# EAGLE schematic ServerHardware (EAGLE 9.5.2)
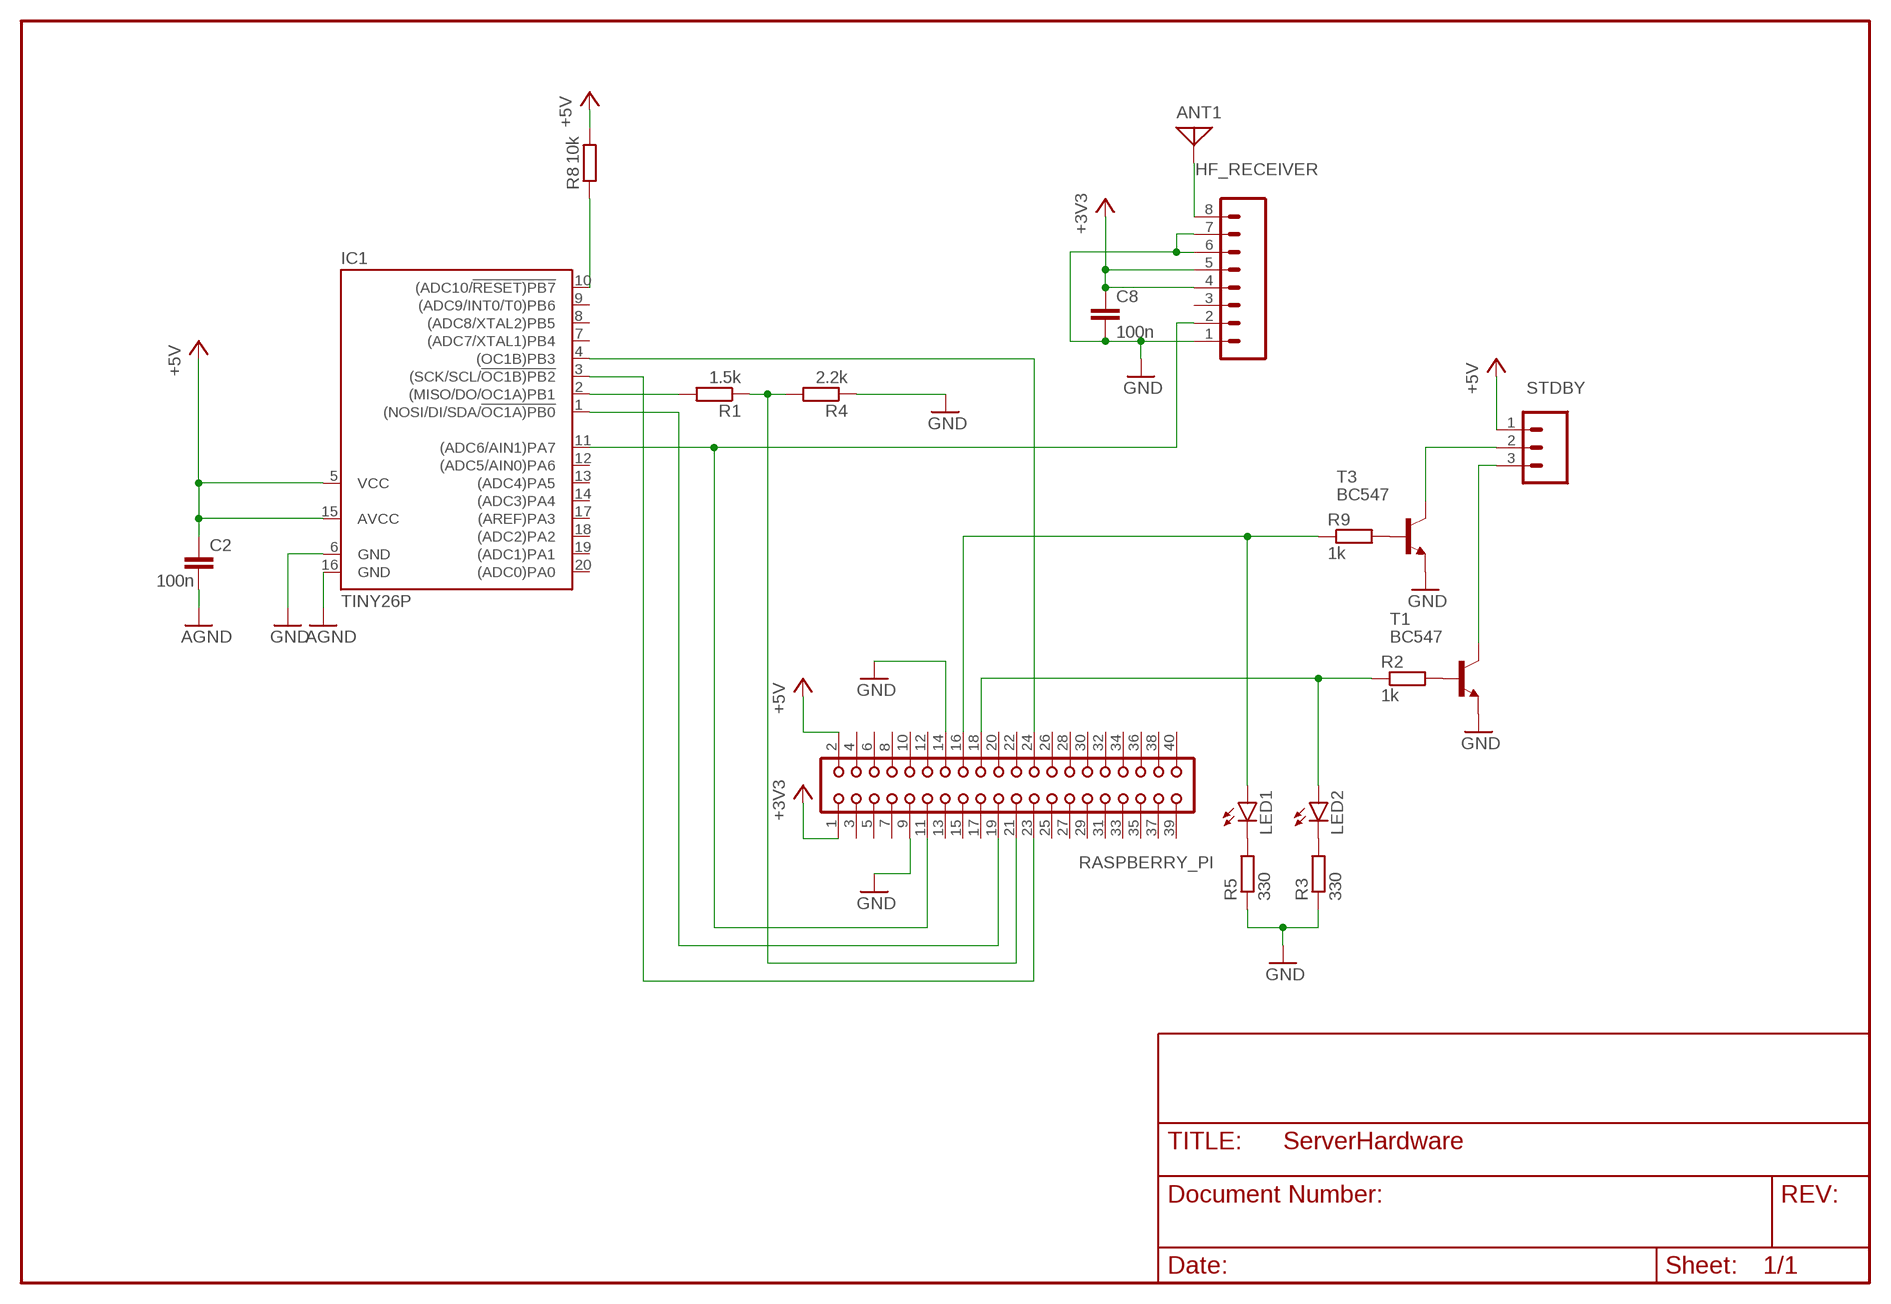
[diagram p0: schematic, sheet 1]

## Parts
ANT1  ANTENNA  [PAD-01]
C2  100n  C-EU025-024X044  [C025-024X044]
C8  100n  C-EU025-024X044  [C025-024X044]
HF_RECEIVER  M08  [08P]
IC1  TINY26P  [DIL20]
LED1  LED5MM  [LED5MM]
LED2  LED5MM  [LED5MM]
R1  1.5k  R-EU_0204/5  [0204/5]
R2  1k  R-EU_0204/5  [0204/5]
R3  330  R-EU_0204/5  [0204/5]
R4  2.2k  R-EU_0204/5  [0204/5]
R5  330  R-EU_0204/5  [0204/5]
R8  10k  R-EU_0204/5  [0204/5]
R9  1k  R-EU_0204/5  [0204/5]
RASPBERRY_PI  CON40  [CON40]
STDBY  M03  [03P]
T1  BC547  [TO92]
T3  BC547  [TO92]

## Nets
+3V3: C8.1 HF_RECEIVER.4 HF_RECEIVER.5 RASPBERRY_PI.1
+5V: C2.1 IC1.5(VCC) IC1.15(AVCC) R8.2 RASPBERRY_PI.2 STDBY.1
GND: C2.2 C8.2 HF_RECEIVER.1 HF_RECEIVER.6 HF_RECEIVER.7 IC1.6(GND) IC1.16(GND) R3.1 R4.1 R5.1 RASPBERRY_PI.9 RASPBERRY_PI.14 T1.1(E) T3.1(E) ; supply symbol labelled AGND
N$1: HF_RECEIVER.2 IC1.11((ADC6/AIN1)PA7) RASPBERRY_PI.11
N$2: IC1.1((NOSI/DI/SDA/!OC1A)PB0) RASPBERRY_PI.19
N$3: IC1.2((MISO/DO/OC1A)PB1) R1.2
N$4: R1.1 R4.2 RASPBERRY_PI.21
N$5: R9.2 T3.2(B)
N$6: IC1.3((SCK/SCL/!OC1B)PB2) RASPBERRY_PI.23
N$7: IC1.4((OC1B)PB3) RASPBERRY_PI.24
N$9: ANT1.1 HF_RECEIVER.8
N$10: R2.2 T1.2(B)
N$11: LED2.A R2.1 RASPBERRY_PI.18
N$12: LED1.A R9.1 RASPBERRY_PI.16
N$13: STDBY.2 T3.3(C)
N$14: STDBY.3 T1.3(C)
N$16: LED1.K(C) R5.2
N$17: LED2.K(C) R3.2
N$21: IC1.10((ADC10/!RESET)PB7) R8.1
Unconnected: HF_RECEIVER.3 IC1.7((ADC7/XTAL1)PB4) IC1.8((ADC8/XTAL2)PB5) IC1.9((ADC9/INT0/T0)PB6) IC1.12((ADC5/AIN0)PA6) IC1.13((ADC4)PA5) IC1.14((ADC3)PA4) IC1.17((AREF)PA3) IC1.18((ADC2)PA2) IC1.19((ADC1)PA1) IC1.20((ADC0)PA0) RASPBERRY_PI.3 RASPBERRY_PI.4 RASPBERRY_PI.5 RASPBERRY_PI.6 RASPBERRY_PI.7 RASPBERRY_PI.8 RASPBERRY_PI.10 RASPBERRY_PI.12 RASPBERRY_PI.13 RASPBERRY_PI.15 RASPBERRY_PI.17 RASPBERRY_PI.20 RASPBERRY_PI.22 RASPBERRY_PI.25 RASPBERRY_PI.26 RASPBERRY_PI.27 RASPBERRY_PI.28 RASPBERRY_PI.29 RASPBERRY_PI.30 RASPBERRY_PI.31 RASPBERRY_PI.32 RASPBERRY_PI.33 RASPBERRY_PI.34 RASPBERRY_PI.35 RASPBERRY_PI.36 RASPBERRY_PI.37 RASPBERRY_PI.38 RASPBERRY_PI.39 RASPBERRY_PI.40

## Library data of the parts
ANT1 = discrete:ANTENNA: Antenna
C2 C8 = rcl:C-EU: CAPACITOR, European symbol
HF_RECEIVER = con-amp-quick:M08: AMP QUICK CONNECTOR; OC_FARNELL: unknown; OC_NEWARK: unknown
IC1 = atmel:TINY26*: 8-bit AVR Microcontroller with 2K Bytes Flash Source: http://www.atmel.com .. doc1477.pdf
LED1 LED2 = led:LED: LED OSRAM: - CHIPLED LG R971, LG N971, LY N971, LG Q971, LY Q971, LO R971, LY R971 LH N974, LH R974 LS Q976, LO Q976, LY Q976 LO Q996 - Hyper CHIPLED LW Q18S LB Q993, LB Q99A, LB R99A - SideLED LS A670, LO A670, LY A670, LG A670, LP A670 LB A673, LV A673, LT A673, LW A673 LH A674 LY A675 LS A676, LA A676, LO A676, LY A676, LW A676 LS A679, LY A679, LG A679 - Hyper Micro SIDELED® LS Y876, LA Y876, LO Y876, LY Y876 LT Y87S - SmartLED LW L88C, LW L88S LB L89C, LB L89S, LG L890 LS L89K, LO L89K, LY L89K LS L896, LA L896, LO L896, LY L896 - TOPLED LS T670, LO T670, LY T670, LG T670, LP T670 LSG T670, LSP T670, LSY T670, LOP T670, LYG T670 LG T671, LOG T671, LSG T671 LB T673, LV T673, LT T673, LW T673 LH T674 LS T676, LA T676, LO T676, LY T676, LB T676, LH T676, LSB T676, LW T676 LB T67C, LV T67C, LT T67C, LS T67K, LO T67K, LY T67K, LW E67C LS E67B, LA E67B, LO E67B, LY E67B, LB E67C, LV E67C, LT E67C LW T67C LS T679, LY T679, LG T679 LS T770, LO T770, LY T770, LG T770, LP T770 LB T773, LV T773, LT T773, LW T773 LH T774 LS E675, LA E675, LY E675, LS T675 LS T776, LA T776, LO T776, LY T776, LB T776 LHGB T686 LT T68C, LB T68C - Hyper Mini TOPLED® LB M676 - Mini TOPLED Santana® LG M470 LS M47K, LO M47K, LY M47K Source: http://www.osram.convergy.de LUXEON: - LUMILED® LXK2-PW12-R00, LXK2-PW12-S00, LXK2-PW14-U00, LXK2-PW14-V00 LXK2-PM12-R00, LXK2-PM12-S00, LXK2-PM14-U00 LXK2-PE12-Q00, LXK2-PE12-R00, LXK2-PE12-S00, LXK2-PE14-T00, LXK2-PE14-U00 LXK2-PB12-K00, LXK2-PB12-L00, LXK2-PB12-M00, LXK2-PB14-N00, LXK2-PB14-P00, LXK2-PB14-Q00 LXK2-PR12-L00, LXK2-PR12-M00, LXK2-PR14-Q00, LXK2-PR14-R00 LXK2-PD12-Q00, LXK2-PD12-R00, LXK2-PD12-S00 LXK2-PH12-R00, LXK2-PH12-S00 LXK2-PL12-P00, LXK2-PL12-Q00, LXK2-PL12-R00 Source: www.luxeon.com KINGBRIGHT: KA-3528ASYC Source: www.kingbright.com
R1-R5 R8 R9 = rcl:R-EU_: RESISTOR, European symbol
RASPBERRY_PI = con-harting:CON40: CONNECTOR; OC_FARNELL: unknown; OC_NEWARK: unknown
STDBY = con-amp-quick:M03: AMP QUICK CONNECTOR; OC_FARNELL: unknown; OC_NEWARK: unknown
T1 T3 = transistor:BC547: NPN TRANSISTOR